# Altium schematic sheet Sheet_STM32_Microcontroller.SchDoc
size 419 x 304 mm
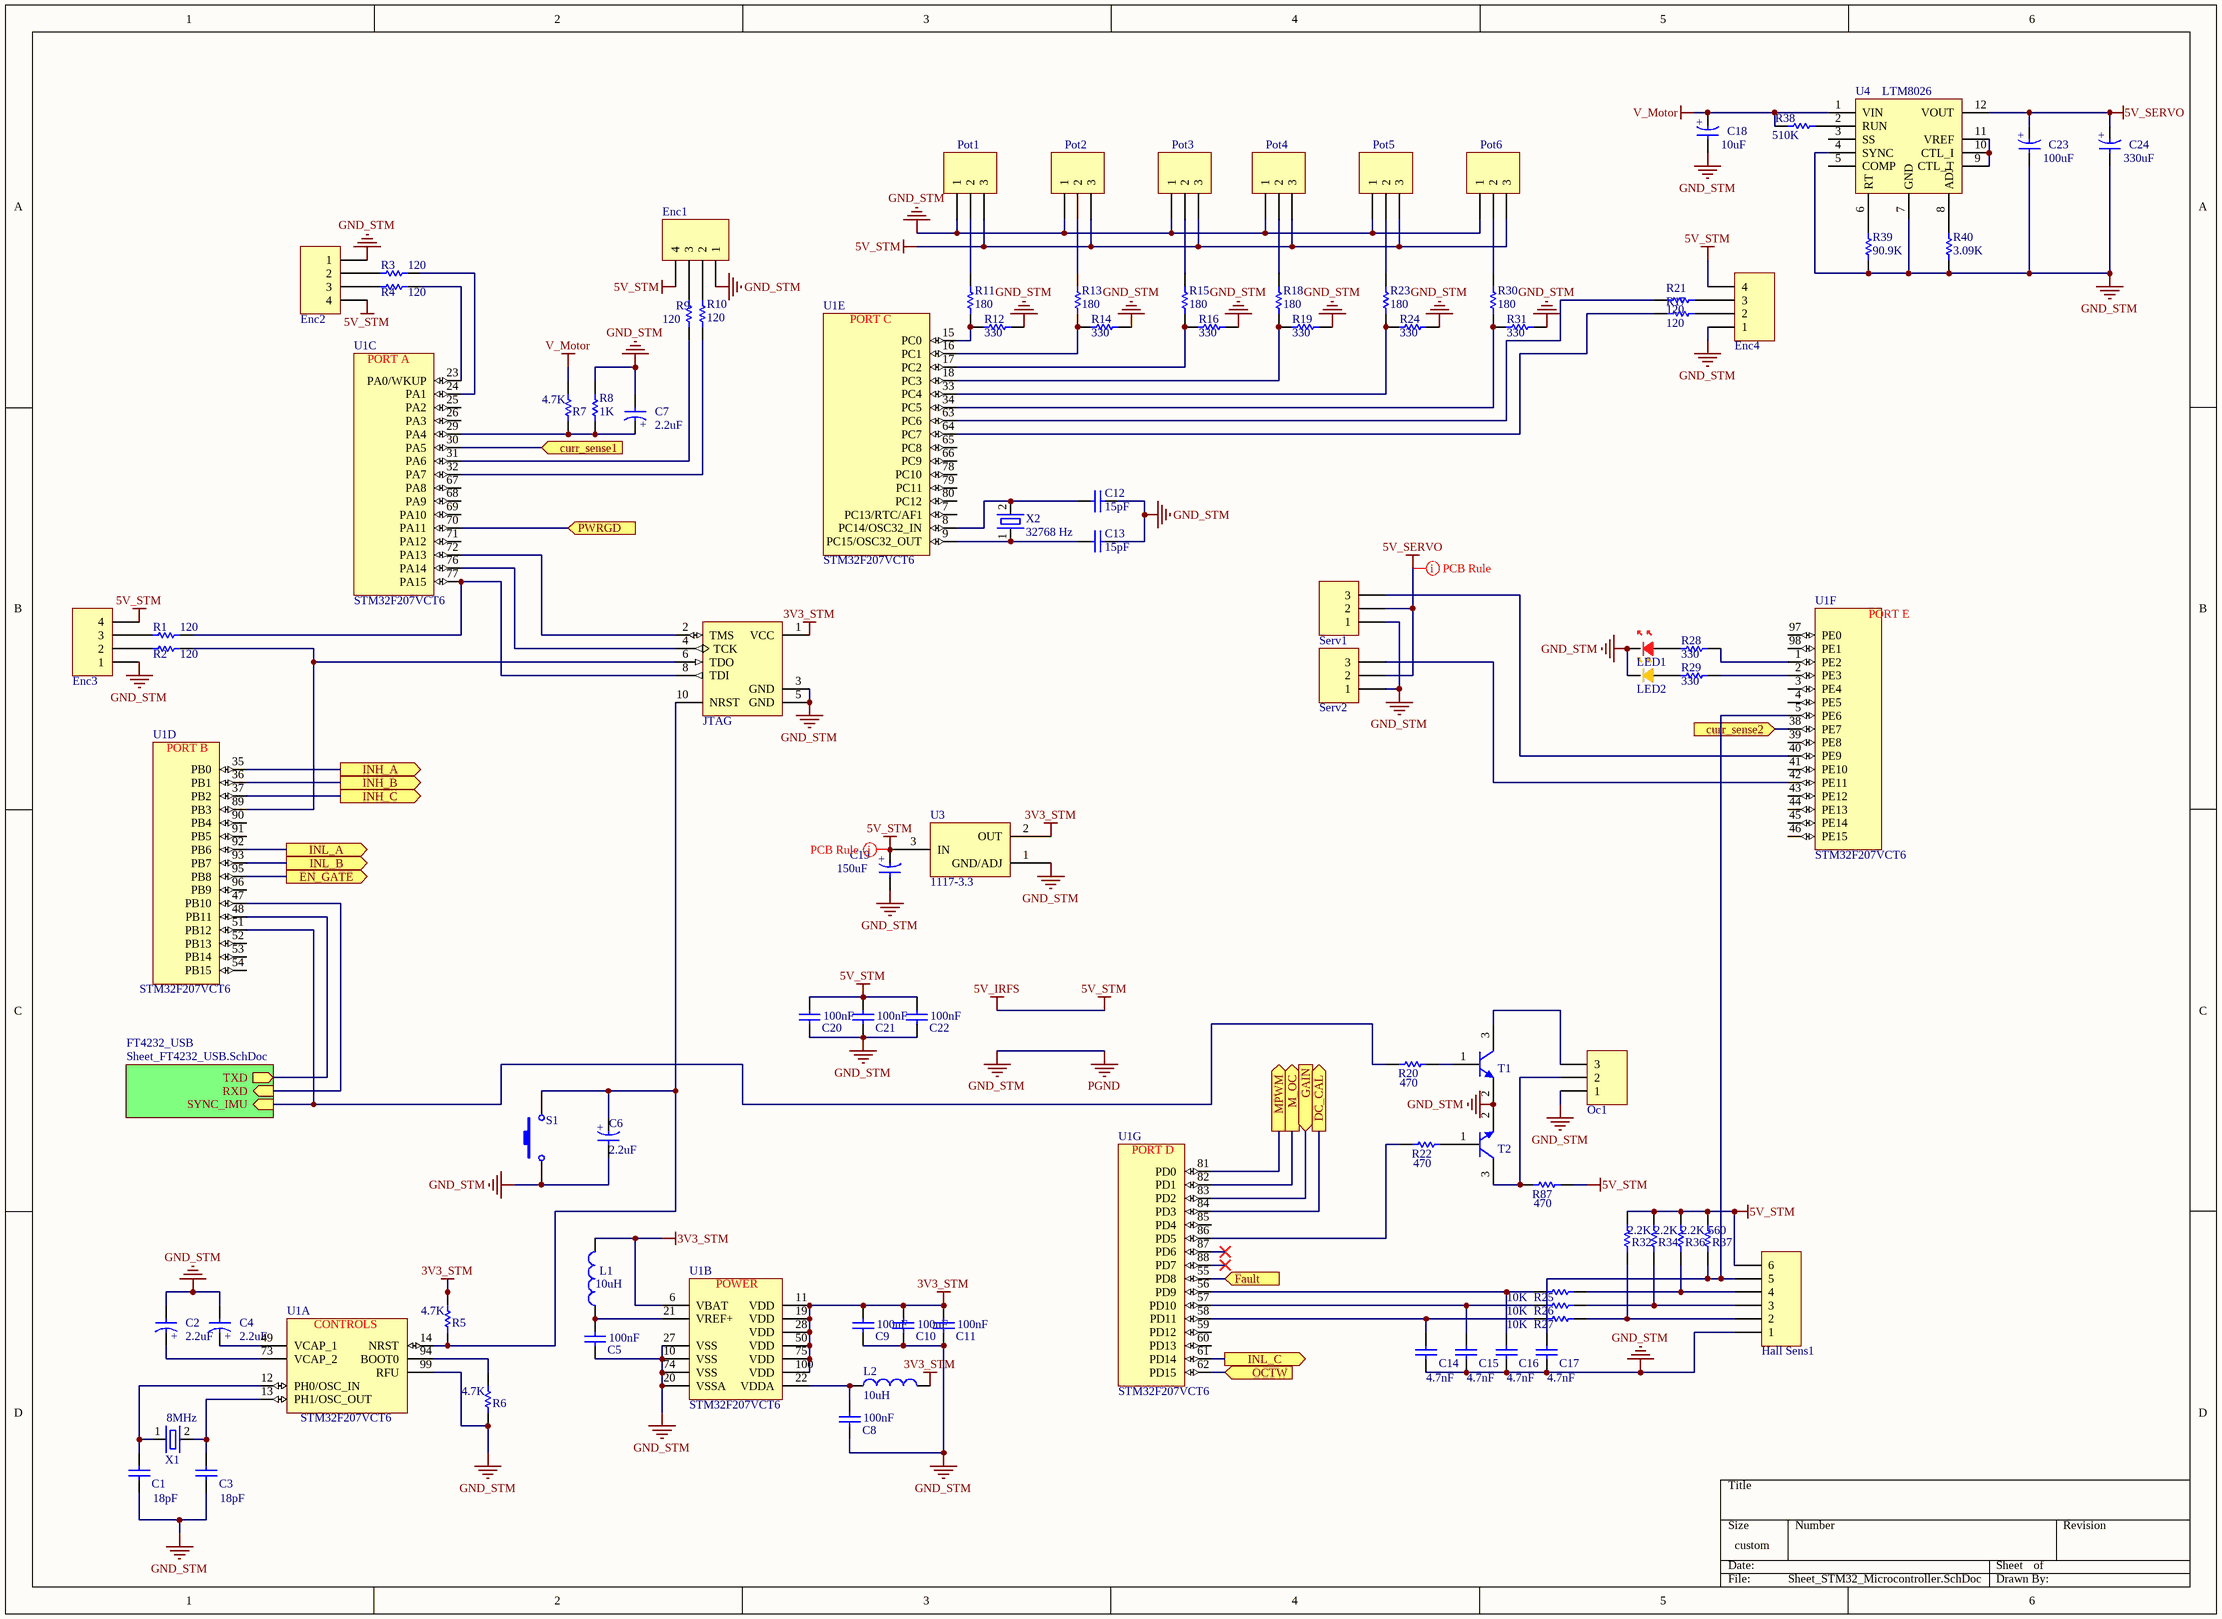
[diagram p0: Sheet_STM32_Microcontroller.SchDoc]

## Parts
C1  18pF  [1608[0603]]
C2  2.2uF  [1608[0603] - Polar]
C3  18pF  [1608[0603]]
C4  2.2uF  [1608[0603] - Polar]
C5  100nF  [1608[0603]]
C6  2.2uF  [1608[0603] - Polar]
C7  2.2uF  [1608[0603] - Polar]
C8  100nF  [1608[0603]]
C9  100nF  [1608[0603]]
C10  100nF  [1608[0603]]
C11  100nF  [1608[0603]]
C12  15pF  [1608[0603]]
C13  15pF  [1608[0603]]
C14  4.7nF  [1608[0603]]
C15  4.7nF  [1608[0603]]
C16  4.7nF  [1608[0603]]
C17  4.7nF  [1608[0603]]
C18  10uF  [6032 [2312]]
C19  150uF  [6032 [2312]]
C20  100nF  [1608[0603]]
C21  100nF  [1608[0603]]
C22  100nF  [1608[0603]]
C23  100uF  [6032 [2312]]
C24  330uF  [6032 [2312]]
H1  Enc3  [Header 4  -MolexPicoBlade]
H2  Enc2  [Header 4  -MolexPicoBlade]
H3  Enc1  [Header 4  -MolexPicoBlade]
H4  JTAG  [HDR-2*5-0.05_Without_Through_Hole]
H5  Serv1  [HDR1X3]
H7  Pot1  [Header 3  -MolexPicoBlade]
H8  Pot2  [Header 3  -MolexPicoBlade]
H9  Pot3  [Header 3  -MolexPicoBlade]
H10  Pot4  [Header 3  -MolexPicoBlade]
H11  Enc4  [Header 4  -MolexPicoBlade]
H12  Pot5  [Header 3  -MolexPicoBlade]
H13  Serv2  [HDR1X3]
H16  Pot6  [Header 3  -MolexPicoBlade]
H17  Oc1  [Header 3  -MolexPicoBlade]
H18  Hall Sens1  [Header 6  ZH-SM4]
L1  10uH  [0805]
L2  10uH  [0805]
LED1  LEDR  [2012[0805]]  (value not drawn)
LED2  LEDY  [2012[0805]]  (value not drawn)
R1  120  [1608[0603]]
R2  120  [1608[0603]]
R3  120  [1608[0603]]
R4  120  [1608[0603]]
R5  4.7K  [1608[0603]]
R6  4.7K  [1608[0603]]
R7  4.7K  [1608[0603]]
R8  1K  [1608[0603]]
R9  120  [1608[0603]]
R10  120  [1608[0603]]
R11  180  [1608[0603]]
R12  330  [1608[0603]]
R13  180  [1608[0603]]
R14  330  [1608[0603]]
R15  180  [1608[0603]]
R16  330  [1608[0603]]
R17  120  [1608[0603]]
R18  180  [1608[0603]]
R19  330  [1608[0603]]
R20  470  [1608[0603]]
R21  120  [1608[0603]]
R22  470  [1608[0603]]
R23  180  [1608[0603]]
R24  330  [1608[0603]]
R25  10K  [1608[0603]]
R26  10K  [1608[0603]]
R27  10K  [1608[0603]]
R28  330  [1608[0603]]
R29  330  [1608[0603]]
R30  180  [1608[0603]]
R31  330  [1608[0603]]
R32  2.2K  [1608[0603]]
R34  2.2K  [1608[0603]]
R36  2.2K  [1608[0603]]
R37  560  [1608[0603]]
R38  510K  [1608[0603]]
R39  90.9K  [1608[0603]]
R40  3.09K  [1608[0603]]
R87  470  [1608[0603]]
S1  SW_TACT  [PTS645SH50SMTR92_LFS]  (value not drawn)
T1  BC817  [SOT-23]  (value not drawn)
T2  BC817  [SOT-23]  (value not drawn)
U1  STM32F207VCT6  [LQFP100_M]  (parts A,B,C,D,E,F,G of 7)
U3  1117-3.3  [SOT-223]
U4  LTM8026  [LGA_Package]
X1  8MHz  [ABM7]
X2  32768 Hz  [0805]

## Sub-sheets
FT4232_USB = Sheet_FT4232_USB.SchDoc: RXD (in), SYNC_IMU (in), TXD (out)

## Ports
curr_sense1 (in), curr_sense2 (in), DC_CAL (out), EN_GATE (out), Fault (in), GAIN (in), INH_A (out), INH_B (out), INH_C (out), INL_A (out), INL_B (out), INL_C (out), M_OC (out), MPWM (out), OCTW (in), PWRGD (in)

## Nets
3V3_STM: C9.2 C10.2 C11.2 H4.1(VCC) L1.2 L2.2 R5.2 U1.6(VBAT) U1.11(VDD) U1.19(VDD) U1.28(VDD) U1.50(VDD) U1.75(VDD) U1.100(VDD) U3.2(OUT)
5V_IRFS: C19.2 C20.2 C21.2 C22.2 H1.4 H2.4 H3.4 H7.3 H8.3 H9.3 H10.3 H11.4 H12.3 H16.3 H18.6 R32.2 R34.2 R36.2 R37.2 R87.1 U3.3(IN)  [also labelled 5V_STM]
5V_SERVO: C23.2 C24.2 H5.2 H13.2 U4.12(VOUT)
GND_STM: C1.1 C2.1 C3.1 C4.1 C5.1 C6.1 C7.1 C8.1 C9.1 C10.1 C11.1 C12.2 C13.2 C14.1 C15.1 C16.1 C17.1 C18.1 C19.1 C20.1 C21.1 C22.1 C23.1 C24.1 H1.1 H2.1 H3.1 H4.3(GND) H4.5(GND) H5.1 H7.1 H8.1 H9.1 H10.1 H11.1 H12.1 H13.1 H16.1 H17.1 H18.1 LED1.2(K) LED2.2(K) R6.1 R8.2 R12.2 R14.2 R16.2 R19.2 R24.2 R31.2 R39.1 R40.1 S1.1 T1.2(E) T2.2(E) U1.10(VSS) U1.20(VSSA) U1.27(VSS) U1.74(VSS) U1.99(RFU) U3.1(GND/ADJ) U4.4(SYNC) U4.7(GND)  [also labelled PGND]
V_Motor: C18.2 R7.2 R38.1 U4.1(VIN)
curr_sense1: U1.30(PA5) ; port curr_sense1
curr_sense2: U1.38(PE7) ; port curr_sense2
DC_CAL: U1.84(PD3) ; port DC_CAL
EN_GATE: U1.95(PB8) ; port EN_GATE
Fault: U1.55(PD8) ; port Fault
GAIN: U1.83(PD2) ; port GAIN
INH_A: U1.35(PB0) ; port INH_A
INH_B: U1.36(PB1) ; port INH_B
INH_C: U1.37(PB2) ; port INH_C
INL_A: U1.92(PB6) ; port INL_A
INL_B: U1.93(PB7) ; port INL_B
INL_C: U1.61(PD14) ; port INL_C
M_OC: U1.82(PD1) ; port M_OC
MPWM: U1.81(PD0) ; port MPWM
OCTW: U1.62(PD15) ; port OCTW
PWRGD: U1.70(PA11) ; port PWRGD
NetC1_2: C1.2 U1.12(PH0/OSC_IN) X1.1(OSC1)
NetC2_2: C2.2 U1.73(VCAP_2)
NetC3_2: C3.2 U1.13(PH1/OSC_OUT) X1.2(OSC2)
NetC4_2: C4.2 U1.49(VCAP_1)
NetC5_2: C5.2 L1.1 U1.21(VREF+)
NetC6_2: C6.2 H4.10(NRST) R5.1 S1.2 U1.14(NRST)
NetC7_2: C7.2 R7.1 R8.1 U1.29(PA4)
NetC8_2: C8.2 L2.1 U1.22(VDDA)
NetC12_1: C12.1 U1.8(PC14/OSC32_IN) X2.2(OSC2)
NetC13_1: C13.1 U1.9(PC15/OSC32_OUT) X2.1(OSC1)
NetC14_2: C14.2 R27.1 U1.58(PD11)
NetC15_2: C15.2 R26.1 U1.57(PD10)
NetC16_2: C16.2 R25.1 U1.56(PD9)
NetC17_2: C17.2 H18.5 R37.1 U1.5(PE6)
NetH1_2: H1.2 R2.1
NetH1_3: H1.3 R1.1
NetH2_2: H2.2 R3.1
NetH2_3: H2.3 R4.1
NetH3_2: H3.2 R10.1
NetH3_3: H3.3 R9.1
NetH4_2: H4.2(TMS) U1.72(PA13)
NetH4_4: H4.4(TCK) U1.76(PA14)
NetH4_6: H4.6(TDO) R2.2 U1.89(PB3)
NetH4_8: H4.8(TDI) R1.2 U1.77(PA15)
NetH5_3: H5.3 U1.40(PE9)
NetH7_2: H7.2 R11.2
NetH8_2: H8.2 R13.2
NetH9_2: H9.2 R15.2
NetH10_2: H10.2 R18.2
NetH11_2: H11.2 R17.1
NetH11_3: H11.3 R21.1
NetH12_2: H12.2 R23.2
NetH13_3: H13.3 U1.42(PE11)
NetH16_2: H16.2 R30.2
NetH17_2: H17.2 R87.2 T2.3(C)
NetH17_3: H17.3 T1.3(C)
NetH18_2: H18.2 R27.2 R32.1
NetH18_3: H18.3 R26.2 R34.1
NetH18_4: H18.4 R25.2 R36.1
NetLED1_1: LED1.1(A) R28.1
NetLED2_1: LED2.1(A) R29.1
NetR3_2: R3.2 U1.24(PA1)
NetR4_2: R4.2 U1.23(PA0/WKUP)
NetR6_2: R6.2 U1.94(BOOT0)
NetR9_2: R9.2 U1.31(PA6)
NetR10_2: R10.2 U1.32(PA7)
NetR11_1: R11.1 R12.1 U1.15(PC0)
NetR13_1: R13.1 R14.1 U1.16(PC1)
NetR15_1: R15.1 R16.1 U1.17(PC2)
NetR17_2: R17.2 U1.64(PC7)
NetR18_1: R18.1 R19.1 U1.18(PC3)
NetR20_1: R20.1 T1.1(B)
NetR20_2: R20.2 U1.51(PB12) ; sheet FT4232_USB/SYNC_IMU
NetR21_2: R21.2 U1.63(PC6)
NetR22_1: R22.1 T2.1(B)
NetR22_2: R22.2 U1.86(PD5)
NetR23_1: R23.1 R24.1 U1.33(PC4)
NetR28_2: R28.2 U1.1(PE2)
NetR29_2: R29.2 U1.2(PE3)
NetR30_1: R30.1 R31.1 U1.34(PC5)
NetR38_2: R38.2 U4.2(RUN)
NetR39_2: R39.2 U4.6(RT)
NetR40_2: R40.2 U4.8(ADJ)
NetU1_47: U1.47(PB10) ; sheet FT4232_USB/RXD
NetU1_48: U1.48(PB11) ; sheet FT4232_USB/TXD
NetU4_9: U4.9(CTL_T) U4.10(CTL_I) U4.11(VREF)

Not connected (* = marked no-connect by the designer): U1 3(PE4) 4(PE5) 7(PC13/RTC/AF1) 25(PA2) 26(PA3) 39(PE8) 41(PE10) 43(PE12) 44(PE13) 45(PE14) 46(PE15) 52(PB13) 53(PB14) 54(PB15) 59(PD12) 60(PD13) 65(PC8) 66(PC9) 67(PA8) 68(PA9) 69(PA10) 71(PA12) 78(PC10) 79(PC11) 80(PC12) 85(PD4) 87(PD6)* 88(PD7)* 90(PB4) 91(PB5) 96(PB9) 97(PE0) 98(PE1); U4 3(SS) 5(COMP)

## Layout directives
rule Width Constraint [Pref Width = 27.559mil    Min Width = 19.685mil    Max Width = 39.37mil]: 5V_IRFS, 5V_SERVO

## Notes on the sheet
- (in symbol Cap_E) +
- (in symbol STM32F207VCT6, part A) CONTROLS
- (in symbol STM32F207VCT6, part B) POWER
- (in symbol STM32F207VCT6, part C) PORT A
- (in symbol STM32F207VCT6, part D) PORT B
- (in symbol STM32F207VCT6, part E) PORT C
- (in symbol STM32F207VCT6, part F) PORT E
- (in symbol STM32F207VCT6, part G) PORT D

## Library data of the parts
C1 C3 C5 C8-C17 C20-C22 = Cap_BP: Capacitor; Supplier 1: Digi-Key
  C1 C3: Value: 18pF; Supplier Part Number 1: 712-1321-1-ND
  C5 C8-C11 C20-C22: Value: 100nF; Supplier Part Number 1: 311-1088-1-ND
  C12 C13: Value: 15pF; Supplier Part Number 1: 712-1318-1-ND
  C14-C17: Value: 4.7nF; Supplier Part Number 1: 445-2712-1-ND
C2 C4 C6 C7 C18 C19 C23 C24 = Cap_E: Capacitor; Supplier 1: Digi-Key
  C2 C4 C6 C7: Value: 2.2uF; Supplier Part Number 1: 478-8647-1-ND
  C18: Value: 10uF; Supplier Part Number 1: 478-7582-6-ND
  C19: Value: 150uF; Supplier Part Number 1: 478-3481-1-ND
  C23: Value: 100uF; Supplier Part Number 1: 478-1824-1-ND
  C24: Value: 330uF; Supplier Part Number 1: 478-8902-1-ND
H1-H3 H11 = Header 4: Supplier 1: Digi-Key; Supplier Part Number 1: WM7608CT-ND
H4 = JTAG-ARM: USB JTAG Programmer; Supplier 1: Digi-Key; Supplier Part Number 1: 609-3695-1-ND
H5 H13 = Header 3: Header, 3-Pin; LatestRevisionDate: 17-Jul-2002; LatestRevisionNote: Re-released for DXP Platform.; Publisher: Altium Limited
H7-H10 H12 H16 H17 = Header 3: Supplier 1: Digi-Key; Supplier Part Number 1: WM7607CT-ND
H18 = Header 6: Supplier 1: Digi-Key; Supplier Part Number 1: 455-1685-1-ND
L1 L2 = Inductor: Value: 10uH; Supplier 1: Digi-Key; Supplier Part Number 1: 587-2045-1-ND
LED1 = LED_R: LED; Value: ?; Supplier 1: Digi-Key; Supplier Part Number 1: 475-1278-1-ND
LED2 = LED_Y: LED; Value: ?; Supplier 1: Digi-Key; Supplier Part Number 1: 475-2560-1-ND
R1-R32 R34 R36-R40 R87 = Res: Supplier 1: Digi-Key
  R1-R4 R9 R10 R17 R21: Value: 120; Supplier Part Number 1: RMCF0603JT120RCT-ND
  R5-R7: Value: 4.7K; Supplier Part Number 1: P4.7KGCT-ND
  R8: Value: 1K; Supplier Part Number 1: P1.0KGCT-ND
  R11 R13 R15 R18 R23 R30: Value: 180; Supplier Part Number 1: RMCF0603JT180RCT-ND
  R12 R14 R16 R19 R24 R28 R29 R31: Value: 330; Supplier Part Number 1: 311-330GRCT-ND
  R20 R22 R87: Value: 470; Supplier Part Number 1: 311-470GRCT-ND
  R25-R27: Value: 10K; Supplier Part Number 1: P10KGCT-ND
  R32 R34 R36: Value: 2.2K; Supplier Part Number 1: RMCF0603JT2K20CT-ND
  R37: Value: 560; Supplier Part Number 1: 311-560HRCT-ND
  R38: Value: 510K; Supplier Part Number 1: P510KHCT-ND
  R39: Value: 90.9K; Supplier Part Number 1: P90.9KHCT-ND
  R40: Value: 3.09K; Supplier Part Number 1: P3.09KHCT-ND
S1 = SW_TACT: Tactile switch; Supplier 1: Digi-Key; Supplier Part Number 1: CKN9085CT-ND
T1 T2 = BC817: NPN SMD Transistor; Supplier 1: Digi-Key; Supplier Part Number 1: BC817-25LT1GOSCT-ND
U1 = STM32F207VCT6: ARM MCU; Supplier 1: Digi-Key; Supplier Part Number 1: 497-11170-ND
U3 = 1117-3.3V: 3.3V Voltage Regulator; Supplier 1: Digi-Key; Supplier Part Number 1: LM1117IMPX-3.3/NOPBCT-ND
X1 X2 = XTAL: Crystal Oscillator; Published: 8-Jun-2000; LatestRevisionDate: 17-Jul-2002; LatestRevisionNote: Re-released for DXP Platform.; PackageReference: R38; Publisher: Altium Limited; Supplier 1: Digi-Key
  X1: Value: 8MHz; Supplier Part Number 1: 535-9831-1-ND
  X2: Value: 32768 Hz; Supplier Part Number 1: 535-12373-1-ND
U4 = LTM8026: Supplier 1: Digi-Key; Supplier Part Number 1: LTM8026EV#PBF-ND